# Altium project Mother Board.PrjPcb (part 2 of 2)

## Sheet Mother Board FPGA.SchDoc
size A2
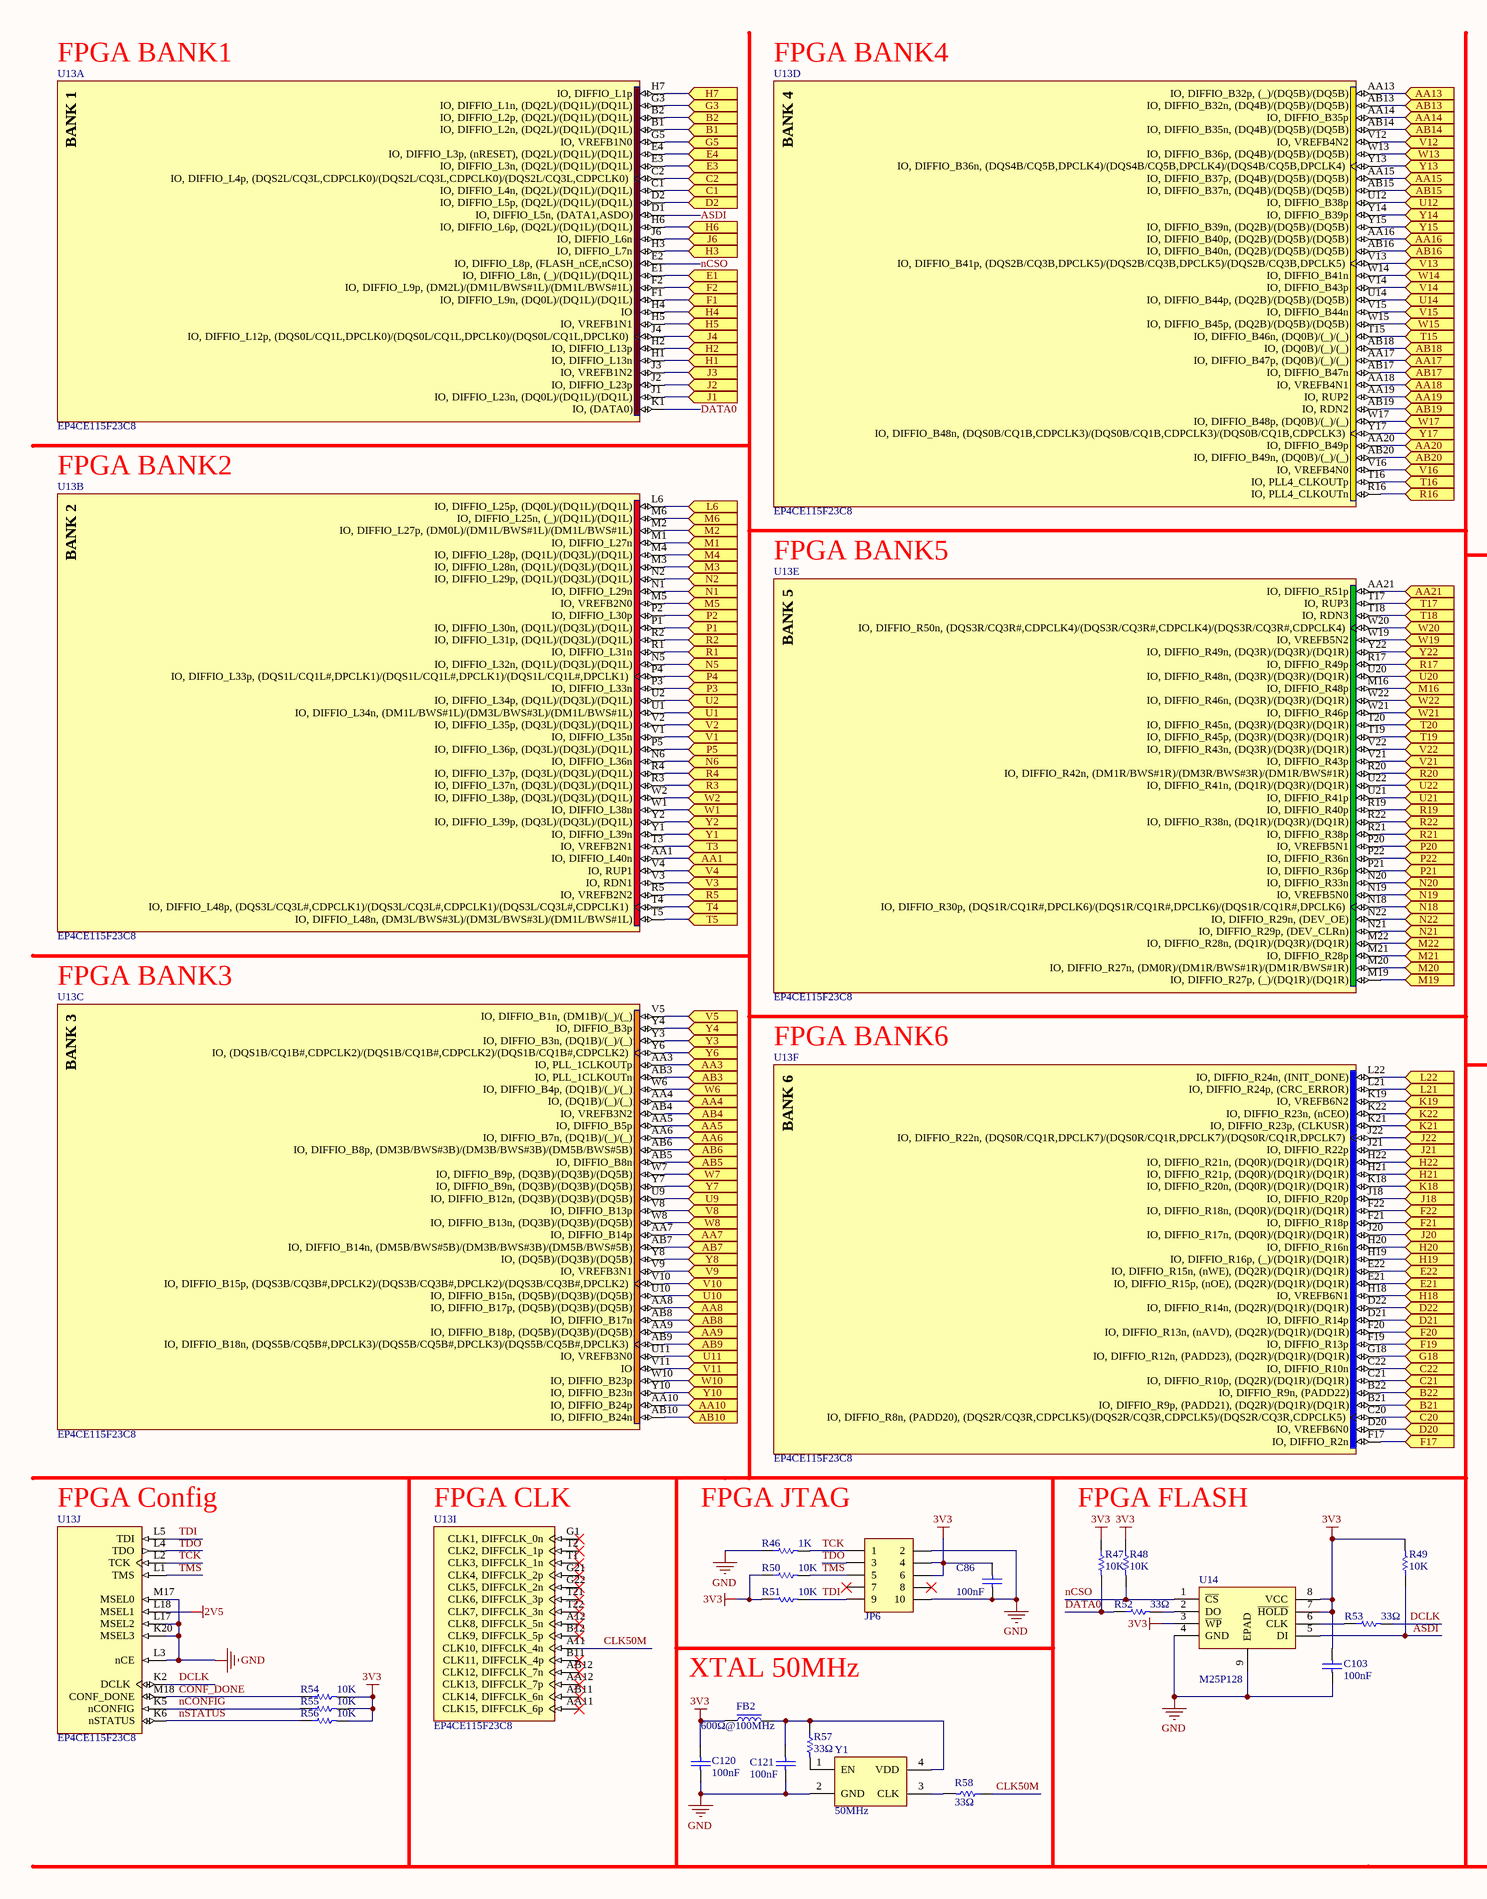
[diagram p8: Mother Board FPGA.SchDoc, left]
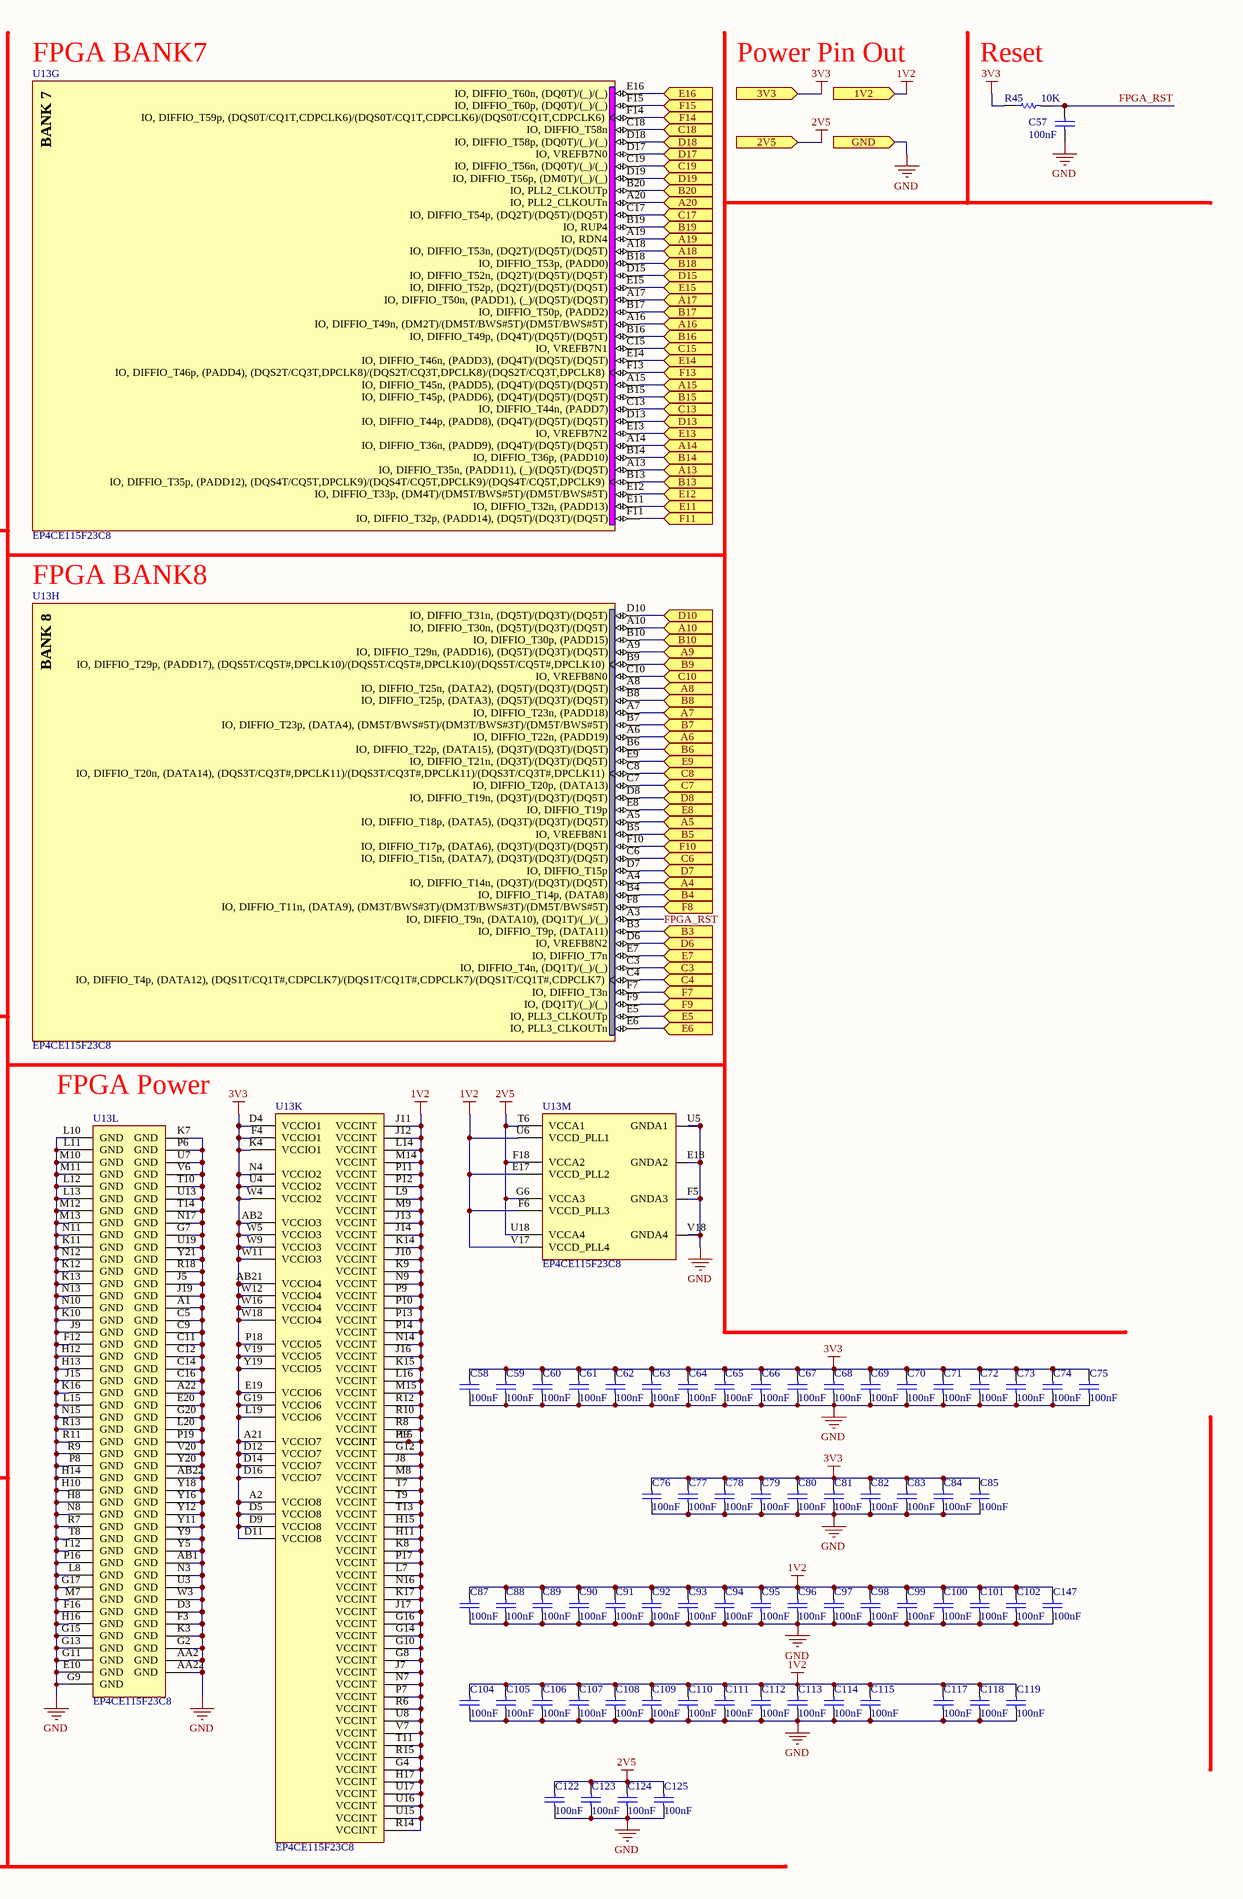
[diagram p9: Mother Board FPGA.SchDoc, right]

### Parts
C57  100nF  [C0402]
C58  100nF  [C0402]
C59  100nF  [C0402]
C60  100nF  [C0402]
C61  100nF  [C0402]
C62  100nF  [C0402]
C63  100nF  [C0402]
C64  100nF  [C0402]
C65  100nF  [C0402]
C66  100nF  [C0402]
C67  100nF  [C0402]
C68  100nF  [C0402]
C69  100nF  [C0402]
C70  100nF  [C0402]
C71  100nF  [C0402]
C72  100nF  [C0402]
C73  100nF  [C0402]
C74  100nF  [C0402]
C75  100nF  [C0402]
C76  100nF  [C0402]
C77  100nF  [C0402]
C78  100nF  [C0402]
C79  100nF  [C0402]
C80  100nF  [C0402]
C81  100nF  [C0402]
C82  100nF  [C0402]
C83  100nF  [C0402]
C84  100nF  [C0402]
C85  100nF  [C0402]
C86  100nF  [C0603]
C87  100nF  [C0402]
C88  100nF  [C0402]
C89  100nF  [C0402]
C90  100nF  [C0402]
C91  100nF  [C0402]
C92  100nF  [C0402]
C93  100nF  [C0402]
C94  100nF  [C0402]
C95  100nF  [C0402]
C96  100nF  [C0402]
C97  100nF  [C0402]
C98  100nF  [C0402]
C99  100nF  [C0402]
C100  100nF  [C0402]
C101  100nF  [C0402]
C102  100nF  [C0402]
C103  100nF  [C0603]
C104  100nF  [C0402]
C105  100nF  [C0402]
C106  100nF  [C0402]
C107  100nF  [C0402]
C108  100nF  [C0402]
C109  100nF  [C0402]
C110  100nF  [C0402]
C111  100nF  [C0402]
C112  100nF  [C0402]
C113  100nF  [C0402]
C114  100nF  [C0402]
C115  100nF  [C0402]
C117  100nF  [C0402]
C118  100nF  [C0402]
C119  100nF  [C0402]
C120  100nF  [C0603]
C121  100nF  [C0603]
C122  100nF  [C0402]
C123  100nF  [C0402]
C124  100nF  [C0402]
C125  100nF  [C0402]
C147  100nF  [C0402]
FB2  600Ω@100MHz  [FB 0603]
JP6  Header 5X2  [DC2.54-10P - L2]  (value not drawn)
R45  10K  [R0402]
R46  1K  [R0603]
R47  10K  [R0603]
R48  10K  [R0603]
R49  10K  [R0603]
R50  10K  [R0603]
R51  10K  [R0603]
R52  33Ω  [R0603]
R53  33Ω  [R0603]
R54  10K  [R0402]
R55  10K  [R0402]
R56  10K  [R0402]
R57  33Ω  [R0603]
R58  33Ω  [R0603]
U13  EP4CE115F23C8  [FBGA484]  (parts A,B,C,D,E,F,G,H,I,J,K,L,M of 13)
U14  M25P128  [WSON8_8X6_MRN]
Y1  50MHz  [XTAL-3225]

### Ports
1V2 (in), 2V5 (in), 3V3 (in), A4 (in), A5 (in), A6 (in), A7 (in), A8 (in), A9 (in), A10 (in), A13 (in), A14 (in), A15 (in), A16 (in), A17 (in), A18 (in), A19 (in), A20 (in), AA1 (in), AA3 (in), AA4 (in), AA5 (in), AA6 (in), AA7 (in), AA8 (in), AA9 (in), AA10 (in), AA13 (in), AA14 (in), AA15 (in), AA16 (in), AA17 (in), AA18 (in), AA19 (in), AA20 (in), AA21 (in), AB3 (in), AB4 (in), AB5 (in), AB6 (in), AB7 (in), AB8 (in), AB9 (in), AB10 (in), AB13 (in), AB14 (in), AB15 (in), AB16 (in), AB17 (in), AB18 (in), AB19 (in), AB20 (in), B1 (in), B2 (in), B3 (in), B4 (in), B5 (in), B6 (in), B7 (in), B8 (in), B9 (in), B10 (in), B13 (in), B14 (in), B15 (in), B16 (in), B17 (in), B18 (in), B19 (in), B20 (in), B21 (in), B22 (in), C1 (in), C2 (in), C3 (in), C4 (in), C6 (in), C7 (in), C8 (in), C10 (in), C13 (in), C15 (in), C17 (in), C18 (in), C19 (in), C20 (in), C21 (in), C22 (in), D2 (in), D6 (in), D7 (in), D8 (in), D10 (in), D13 (in), D15 (in), D17 (in), D18 (in), D19 (in), D20 (in), D21 (in), D22 (in), E1 (in), E3 (in), E4 (in), E5 (in), E6 (in), E7 (in), E8 (in), E9 (in), E11 (in), E12 (in), E13 (in), E14 (in), E15 (in), E16 (in), E21 (in), E22 (in), F1 (in), F2 (in), F7 (in), F8 (in), F9 (in), F10 (in), F11 (in), F13 (in), F14 (in), F15 (in), F17 (in), F19 (in), F20 (in), F21 (in), F22 (in), G3 (in), G5 (in), G18 (in), GND (in), H1 (in), H2 (in), H3 (in), H4 (in), H5 (in), H6 (in), H7 (in), H18 (in), H19 (in), H20 (in), H21 (in), H22 (in), J1 (in), J2 (in), J3 (in), J4 (in), J6 (in), J18 (in), J20 (in), J21 (in), J22 (in), K18 (in), K19 (in), K21 (in), K22 (in), L6 (in), L21 (in), L22 (in), M1 (in), M2 (in), M3 (in), M4 (in), M5 (in), M6 (in), M16 (in), M19 (in), M20 (in), M21 (in), M22 (in), N1 (in), N2 (in), N5 (in), N6 (in), N18 (in), N19 (in), N20 (in), N21 (in), N22 (in), P1 (in), P2 (in), P3 (in), P4 (in), P5 (in), P20 (in), P21 (in), P22 (in), R1 (in), R2 (in), R3 (in), R4 (in), R5 (in), R16 (in), R17 (in), R19 (in), R20 (in), R21 (in), R22 (in), T3 (in), T4 (in), T5 (in), T15 (in), T16 (in), T17 (in), T18 (in), T19 (in), T20 (in), U1 (in), U2 (in), U9 (in), U10 (in), U11 (in), U12 (in), U14 (in), U20 (in), U21 (in), U22 (in), V1 (in), V2 (in), V3 (in), V4 (in), V5 (in), V8 (in), V9 (in), V10 (in), V11 (in), V12 (in), V13 (in), V14 (in), V15 (in), V16 (in), V21 (in), V22 (in), W1 (in), W2 (in), W6 (in), W7 (in), W8 (in), W10 (in), W13 (in), W14 (in), W15 (in), W17 (in), W19 (in), W20 (in), W21 (in), W22 (in), Y1 (in), Y2 (in), Y3 (in), Y4 (in), Y6 (in), Y7 (in), Y8 (in), Y10 (in), Y13 (in), Y14 (in), Y15 (in), Y17 (in), Y22 (in)

### Nets
1V2: C87.2 C88.2 C89.2 C90.2 C91.2 C92.2 C93.2 C94.2 C95.2 C96.2 C97.2 C98.2 C99.2 C100.2 C101.2 C102.2 C104.2 C105.2 C106.2 C107.2 C108.2 C109.2 C110.2 C111.2 C112.2 C113.2 C114.2 C115.2 C117.2 C118.2 C119.2 C147.2 U13.E17(VCCD_PLL2) U13.F6(VCCD_PLL3) U13.G4(VCCINT) U13.G8(VCCINT) U13.G10(VCCINT) U13.G12(VCCINT) U13.G14(VCCINT) U13.G16(VCCINT) U13.H9(VCCINT) U13.H11(VCCINT) U13.H15(VCCINT) U13.H17(VCCINT) U13.J7(VCCINT) U13.J8(VCCINT) U13.J10(VCCINT) U13.J11(VCCINT) U13.J12(VCCINT) U13.J13(VCCINT) U13.J14(VCCINT) U13.J16(VCCINT) U13.J17(VCCINT) U13.K8(VCCINT) U13.K9(VCCINT) U13.K14(VCCINT) U13.K15(VCCINT) U13.K17(VCCINT) U13.L7(VCCINT) U13.L9(VCCINT) U13.L14(VCCINT) U13.L16(VCCINT) U13.M8(VCCINT) U13.M9(VCCINT) U13.M14(VCCINT) U13.M15(VCCINT) U13.N7(VCCINT) U13.N9(VCCINT) U13.N14(VCCINT) U13.N16(VCCINT) U13.P7(VCCINT) U13.P9(VCCINT) U13.P10(VCCINT) U13.P11(VCCINT) U13.P12(VCCINT) U13.P13(VCCINT) U13.P14(VCCINT) U13.P15(VCCINT) U13.P17(VCCINT) U13.R6(VCCINT) U13.R8(VCCINT) U13.R10(VCCINT) U13.R12(VCCINT) U13.R14(VCCINT) U13.R15(VCCINT) U13.T7(VCCINT) U13.T9(VCCINT) U13.T11(VCCINT) U13.T13(VCCINT) U13.U6(VCCD_PLL1) U13.U8(VCCINT) U13.U15(VCCINT) U13.U16(VCCINT) U13.U17(VCCINT) U13.V7(VCCINT) U13.V17(VCCD_PLL4) ; port 1V2
2V5: C122.2 C123.2 C124.2 C125.2 U13.F18(VCCA2) U13.G6(VCCA3) U13.L18(MSEL1) U13.T6(VCCA1) U13.U18(VCCA4) ; port 2V5
3V3: C58.2 C59.2 C60.2 C61.2 C62.2 C63.2 C64.2 C65.2 C66.2 C67.2 C68.2 C69.2 C70.2 C71.2 C72.2 C73.2 C74.2 C75.2 C76.2 C77.2 C78.2 C79.2 C80.2 C81.2 C82.2 C83.2 C84.2 C85.2 C86.2 C103.1 C120.1 FB2.1 JP6.4 JP6.6 R45.1 R47.1 R48.1 R49.2 R50.1 R51.1 R54.2 R55.2 R56.2 U13.A2(VCCIO8) U13.A21(VCCIO7) U13.AB2(VCCIO3) U13.AB21(VCCIO4) U13.D4(VCCIO1) U13.D5(VCCIO8) U13.D9(VCCIO8) U13.D11(VCCIO8) U13.D12(VCCIO7) U13.D14(VCCIO7) U13.D16(VCCIO7) U13.E19(VCCIO6) U13.F4(VCCIO1) U13.G19(VCCIO6) U13.K4(VCCIO1) U13.L19(VCCIO6) U13.N4(VCCIO2) U13.P18(VCCIO5) U13.U4(VCCIO2) U13.V19(VCCIO5) U13.W4(VCCIO2) U13.W5(VCCIO3) U13.W9(VCCIO3) U13.W11(VCCIO3) U13.W12(VCCIO4) U13.W16(VCCIO4) U13.W18(VCCIO4) U13.Y19(VCCIO5) U14.3(~{WP}) U14.7(~{HOLD}) U14.8(VCC) ; port 3V3
GND: C57.1 C58.1 C59.1 C60.1 C61.1 C62.1 C63.1 C64.1 C65.1 C66.1 C67.1 C68.1 C69.1 C70.1 C71.1 C72.1 C73.1 C74.1 C75.1 C76.1 C77.1 C78.1 C79.1 C80.1 C81.1 C82.1 C83.1 C84.1 C85.1 C86.1 C87.1 C88.1 C89.1 C90.1 C91.1 C92.1 C93.1 C94.1 C95.1 C96.1 C97.1 C98.1 C99.1 C100.1 C101.1 C102.1 C103.2 C104.1 C105.1 C106.1 C107.1 C108.1 C109.1 C110.1 C111.1 C112.1 C113.1 C114.1 C115.1 C117.1 C118.1 C119.1 C120.2 C121.1 C122.1 C123.1 C124.1 C125.1 C147.1 JP6.2 JP6.10 R46.1 U13.A1(GND) U13.A22(GND) U13.AA2(GND) U13.AA22(GND) U13.AB1(GND) U13.AB22(GND) U13.C5(GND) U13.C9(GND) U13.C11(GND) U13.C12(GND) U13.C14(GND) U13.C16(GND) U13.D3(GND) U13.E10(GND) U13.E18(GNDA2) U13.E20(GND) U13.F3(GND) U13.F5(GNDA3) U13.F12(GND) U13.F16(GND) U13.G2(GND) U13.G7(GND) U13.G9(GND) U13.G11(GND) U13.G13(GND) U13.G15(GND) U13.G17(GND) U13.G20(GND) U13.H8(GND) U13.H10(GND) U13.H12(GND) U13.H13(GND) U13.H14(GND) U13.H16(GND) U13.J5(GND) U13.J9(GND) U13.J15(GND) U13.J19(GND) U13.K3(GND) U13.K7(GND) U13.K10(GND) U13.K11(GND) U13.K12(GND) U13.K13(GND) U13.K16(GND) U13.K20(MSEL3) U13.L3(nCE) U13.L8(GND) U13.L10(GND) U13.L11(GND) U13.L12(GND) U13.L13(GND) U13.L15(GND) U13.L17(MSEL2) U13.L20(GND) U13.M7(GND) U13.M10(GND) U13.M11(GND) U13.M12(GND) U13.M13(GND) U13.M17(MSEL0) U13.N3(GND) U13.N8(GND) U13.N10(GND) U13.N11(GND) U13.N12(GND) U13.N13(GND) U13.N15(GND) U13.N17(GND) U13.P6(GND) U13.P8(GND) U13.P16(GND) U13.P19(GND) U13.R7(GND) U13.R9(GND) U13.R11(GND) U13.R13(GND) U13.R18(GND) U13.T8(GND) U13.T10(GND) U13.T12(GND) U13.T14(GND) U13.U3(GND) U13.U5(GNDA1) U13.U7(GND) U13.U13(GND) U13.U19(GND) U13.V6(GND) U13.V18(GNDA4) U13.V20(GND) U13.W3(GND) U13.Y5(GND) U13.Y9(GND) U13.Y11(GND) U13.Y12(GND) U13.Y16(GND) U13.Y18(GND) U13.Y20(GND) U13.Y21(GND) U14.4(GND) U14.9(EPAD) Y1.2(GND) ; port GND
ASDI: R49.1 U13.D1(IO,_DIFFIO_L5n,_(DATA1,ASDO)) U14.5(DI)
CLK50M: R58.1 U13.A11(CLK10,_DIFFCLK_4n)
ClkA: U13.M22(IO,_DIFFIO_R28n,_(DQ1R)/(DQ3R)/(DQ1R)) ; port M22
ClkA: U13.N1(IO,_DIFFIO_L29n) ; port N1  [a separate net that carries the same name]
ClkA: U13.W2(IO,_DIFFIO_L38p,_(DQ3L)/(DQ3L)/(DQ1L)) ; port W2  [a separate net that carries the same name]
ClkA: U13.V21(IO,_DIFFIO_R43p) ; port V21  [a separate net that carries the same name]
ClkC: U13.W22(IO,_DIFFIO_R46n,_(DQ3R)/(DQ3R)/(DQ1R)) ; port W22
ClkC: U13.M2(IO,_DIFFIO_L27p,_(DM0L)/(DM1L/BWS#1L)/(DM1L/BWS#1L)) ; port M2  [a separate net that carries the same name]
ClkC: U13.V1(IO,_DIFFIO_L35n) ; port V1  [a separate net that carries the same name]
ClkC: U13.N21(IO,_DIFFIO_R29p,_(DEV_CLRn)) ; port N21  [a separate net that carries the same name]
ClkVIN: U13.L21(IO,_DIFFIO_R24p,_(CRC_ERROR)) ; port L21
CONF_DONE: R54.1 U13.M18(CONF_DONE)
DATA0: R47.2 R52.1 U13.K1(IO,_(DATA0))
DataA: U13.M21(IO,_DIFFIO_R28p) ; port M21
DataA: U13.N2(IO,_DIFFIO_L29p,_(DQ1L)/(DQ3L)/(DQ1L)) ; port N2  [a separate net that carries the same name]
DataA: U13.W1(IO,_DIFFIO_L38n) ; port W1  [a separate net that carries the same name]
DataA: U13.V22(IO,_DIFFIO_R43n,_(DQ3R)/(DQ3R)/(DQ1R)) ; port V22  [a separate net that carries the same name]
DataC: U13.W21(IO,_DIFFIO_R46p) ; port W21
DataC: U13.M1(IO,_DIFFIO_L27n) ; port M1  [a separate net that carries the same name]
DataC: U13.V2(IO,_DIFFIO_L35p,_(DQ3L)/(DQ3L)/(DQ1L)) ; port V2  [a separate net that carries the same name]
DataC: U13.N22(IO,_DIFFIO_R29n,_(DEV_OE)) ; port N22  [a separate net that carries the same name]
DataVIN: U13.L22(IO,_DIFFIO_R24n,_(INIT_DONE)) ; port L22
DCLK: R53.2 U13.K2(DCLK)
FPGA_RST: C57.2 R45.2 U13.A3(IO,_DIFFIO_T9n,_(DATA10),_(DQ1T)/(_)/(_))
FSMC_A0: U13.AA7(IO,_DIFFIO_B14p) ; port AA7
FSMC_A1: U13.AB7(IO,_DIFFIO_B14n,_(DM5B/BWS#5B)/(DM3B/BWS#3B)/(DM5B/BWS#5B)) ; port AB7
FSMC_A2: U13.AA8(IO,_DIFFIO_B17p,_(DQ5B)/(DQ3B)/(DQ5B)) ; port AA8
FSMC_A3: U13.AB8(IO,_DIFFIO_B17n) ; port AB8
FSMC_A4: U13.AA9(IO,_DIFFIO_B18p,_(DQ5B)/(DQ3B)/(DQ5B)) ; port AA9
FSMC_A5: U13.AB9(IO,_DIFFIO_B18n,_(DQS5B/CQ5B#,DPCLK3)/(DQS5B/CQ5B#,DPCLK3)/(DQS5B/CQ5B#,DPCLK3)) ; port AB9
FSMC_A6: U13.Y13(IO,_DIFFIO_B36n,_(DQS4B/CQ5B,DPCLK4)/(DQS4B/CQ5B,DPCLK4)/(DQS4B/CQ5B,DPCLK4)) ; port Y13
FSMC_A7: U13.Y14(IO,_DIFFIO_B39p) ; port Y14
FSMC_A8: U13.Y15(IO,_DIFFIO_B39n,_(DQ2B)/(DQ5B)/(DQ5B)) ; port Y15
FSMC_A9: U13.AA15(IO,_DIFFIO_B37p,_(DQ4B)/(DQ5B)/(DQ5B)) ; port AA15
FSMC_A10: U13.AA16(IO,_DIFFIO_B40p,_(DQ2B)/(DQ5B)/(DQ5B)) ; port AA16
FSMC_A11: U13.AB16(IO,_DIFFIO_B40n,_(DQ2B)/(DQ5B)/(DQ5B)) ; port AB16
FSMC_D0: U13.AB13(IO,_DIFFIO_B32n,_(DQ4B)/(DQ5B)/(DQ5B)) ; port AB13
FSMC_D1: U13.AA13(IO,_DIFFIO_B32p,_(_)/(DQ5B)/(DQ5B)) ; port AA13
FSMC_D2: U13.AA5(IO,_DIFFIO_B5p) ; port AA5
FSMC_D3: U13.AB5(IO,_DIFFIO_B8n) ; port AB5
FSMC_D4: U13.AA17(IO,_DIFFIO_B47p,_(DQ0B)/(_)/(_)) ; port AA17
FSMC_D5: U13.AB17(IO,_DIFFIO_B47n) ; port AB17
FSMC_D6: U13.AA18(IO,_VREFB4N1) ; port AA18
FSMC_D7: U13.AB18(IO,_(DQ0B)/(_)/(_)) ; port AB18
FSMC_D8: U13.AA19(IO,_RUP2) ; port AA19
FSMC_D9: U13.AB19(IO,_RDN2) ; port AB19
FSMC_D10: U13.AA20(IO,_DIFFIO_B49p) ; port AA20
FSMC_D11: U13.AB20(IO,_DIFFIO_B49n,_(DQ0B)/(_)/(_)) ; port AB20
FSMC_D12: U13.AA21(IO,_DIFFIO_R51p) ; port AA21
FSMC_D13: U13.AB15(IO,_DIFFIO_B37n,_(DQ4B)/(DQ5B)/(DQ5B)) ; port AB15
FSMC_D14: U13.AB14(IO,_DIFFIO_B35n,_(DQ4B)/(DQ5B)/(DQ5B)) ; port AB14
FSMC_D15: U13.AA14(IO,_DIFFIO_B35p) ; port AA14
FSMC_NE2: U13.AB4(IO,_VREFB3N2) ; port AB4
FSMC_NOE: U13.AA6(IO,_DIFFIO_B7n,_(DQ1B)/(_)/(_)) ; port AA6
FSMC_NWE: U13.AB6(IO,_DIFFIO_B8p,_(DM3B/BWS#3B)/(DM3B/BWS#3B)/(DM5B/BWS#5B)) ; port AB6
IMU nCS BMP280: U13.H1(IO,_DIFFIO_L13n) ; port H1
IMU nCS MPU9250: U13.F2(IO,_DIFFIO_L9p,_(DM2L)/(DM1L/BWS#1L)/(DM1L/BWS#1L)) ; port F2
IMU SCLK: U13.F1(IO,_DIFFIO_L9n,_(DQ0L)/(DQ1L)/(DQ1L)) ; port F1
IMU SDI: U13.H2(IO,_DIFFIO_L13p) ; port H2
IMU SDO: U13.J2(IO,_DIFFIO_L23p) ; port J2
INa: U13.R20(IO,_DIFFIO_R42n,_(DM1R/BWS#1R)/(DM3R/BWS#3R)/(DM1R/BWS#1R)) ; port R20
INa: U13.P2(IO,_DIFFIO_L30p) ; port P2  [a separate net that carries the same name]
INa: U13.T4(IO,_DIFFIO_L48p,_(DQS3L/CQ3L#,CDPCLK1)/(DQS3L/CQ3L#,CDPCLK1)/(DQS3L/CQ3L#,CDPCLK1)) ; port T4  [a separate net that carries the same name]
INa: U13.U22(IO,_DIFFIO_R41n,_(DQ1R)/(DQ3R)/(DQ1R)) ; port U22  [a separate net that carries the same name]
INb: U13.T20(IO,_DIFFIO_R45n,_(DQ3R)/(DQ3R)/(DQ1R)) ; port T20
INb: U13.R2(IO,_DIFFIO_L31p,_(DQ1L)/(DQ3L)/(DQ1L)) ; port R2  [a separate net that carries the same name]
INb: U13.R4(IO,_DIFFIO_L37p,_(DQ3L)/(DQ3L)/(DQ1L)) ; port R4  [a separate net that carries the same name]
INb: U13.R22(IO,_DIFFIO_R38n,_(DQ1R)/(DQ3R)/(DQ1R)) ; port R22  [a separate net that carries the same name]
INc: U13.U20(IO,_DIFFIO_R48n,_(DQ3R)/(DQ3R)/(DQ1R)) ; port U20
INc: U13.P4(IO,_DIFFIO_L33p,_(DQS1L/CQ1L#,DPCLK1)/(DQS1L/CQ1L#,DPCLK1)/(DQS1L/CQ1L#,DPCLK1)) ; port P4  [a separate net that carries the same name]
INc: U13.U2(IO,_DIFFIO_L34p,_(DQ1L)/(DQ3L)/(DQ1L)) ; port U2  [a separate net that carries the same name]
INc: U13.P22(IO,_DIFFIO_R36n) ; port P22  [a separate net that carries the same name]
nCONFIG: R55.1 U13.K5(nCONFIG)
nCSO: R48.2 U13.E2(IO,_DIFFIO_L8p,_(FLASH_nCE,nCSO)) U14.1(~{CS})
nSTATUS: R56.1 U13.K6(nSTATUS)
Pos DIR: U13.B22(IO,_DIFFIO_R9n,_(PADD22)) ; port B22
Pos DIR: U13.B1(IO,_DIFFIO_L2n,_(DQ2L)/(DQ1L)/(DQ1L)) ; port B1  [a separate net that carries the same name]
Pos DIR: U13.AB3(IO,_PLL_1CLKOUTn) ; port AB3  [a separate net that carries the same name]
Pos DIR: U13.AA10(IO,_DIFFIO_B24p) ; port AA10  [a separate net that carries the same name]
Pos RXD: U13.B21(IO,_DIFFIO_R9p,_(PADD21),_(DQ2R)/(DQ1R)/(DQ1R)) ; port B21
Pos RXD: U13.C2(IO,_DIFFIO_L4p,_(DQS2L/CQ3L,CDPCLK0)/(DQS2L/CQ3L,CDPCLK0)/(DQS2L/CQ3L,CDPCLK0)) ; port C2  [a separate net that carries the same name]
Pos RXD: U13.AA4(IO,_(DQ1B)/(_)/(_)) ; port AA4  [a separate net that carries the same name]
Pos RXD: U13.AB10(IO,_DIFFIO_B24n) ; port AB10  [a separate net that carries the same name]
Pos TXD: U13.C21(IO,_DIFFIO_R10p,_(DQ2R)/(DQ1R)/(DQ1R)) ; port C21
Pos TXD: U13.B2(IO,_DIFFIO_L2p,_(DQ2L)/(DQ1L)/(DQ1L)) ; port B2  [a separate net that carries the same name]
Pos TXD: U13.AA3(IO,_PLL_1CLKOUTp) ; port AA3  [a separate net that carries the same name]
Pos TXD: U13.Y10(IO,_DIFFIO_B23n) ; port Y10  [a separate net that carries the same name]
SDa: U13.P20(IO,_VREFB5N1) ; port P20
SDa: U13.P1(IO,_DIFFIO_L30n,_(DQ1L)/(DQ3L)/(DQ1L)) ; port P1  [a separate net that carries the same name]
SDa: U13.T3(IO,_VREFB2N1) ; port T3  [a separate net that carries the same name]
SDa: U13.U21(IO,_DIFFIO_R41p) ; port U21  [a separate net that carries the same name]
SDb: U13.R19(IO,_DIFFIO_R40p) ; port R19
SDb: U13.R1(IO,_DIFFIO_L31n) ; port R1  [a separate net that carries the same name]
SDb: U13.R3(IO,_DIFFIO_L37n,_(DQ3L)/(DQ3L)/(DQ1L)) ; port R3  [a separate net that carries the same name]
SDb: U13.R21(IO,_DIFFIO_R38p) ; port R21  [a separate net that carries the same name]
SDc: U13.T19(IO,_DIFFIO_R45p,_(DQ3R)/(DQ3R)/(DQ1R)) ; port T19
SDc: U13.P3(IO,_DIFFIO_L33n) ; port P3  [a separate net that carries the same name]
SDc: U13.U1(IO,_DIFFIO_L34n,_(DM1L/BWS#1L)/(DM3L/BWS#3L)/(DM1L/BWS#1L)) ; port U1  [a separate net that carries the same name]
SDc: U13.P21(IO,_DIFFIO_R36p) ; port P21  [a separate net that carries the same name]
TCK: JP6.1 R46.2 U13.L2(TCK)
TDI: JP6.9 R51.2 U13.L5(TDI)
TDO: JP6.3 U13.L4(TDO)
TMS: JP6.5 R50.2 U13.L1(TMS)
NetC121_2: C121.2 FB2.2 R57.1 Y1.4(VDD)
NetR52_2: R52.2 U14.2(DO)
NetR53_1: R53.1 U14.6(CLK)
NetR57_2: R57.2 Y1.1(EN)
NetR58_2: R58.2 Y1.3(CLK)
NetU13_A4: U13.A4(IO,_DIFFIO_T14n,_(DQ3T)/(DQ3T)/(DQ5T)) ; port A4
NetU13_A5: U13.A5(IO,_DIFFIO_T18p,_(DATA5),_(DQ3T)/(DQ3T)/(DQ5T)) ; port A5
NetU13_A6: U13.A6(IO,_DIFFIO_T22n,_(PADD19)) ; port A6
NetU13_A7: U13.A7(IO,_DIFFIO_T23n,_(PADD18)) ; port A7
NetU13_A8: U13.A8(IO,_DIFFIO_T25n,_(DATA2),_(DQ5T)/(DQ3T)/(DQ5T)) ; port A8
NetU13_A9: U13.A9(IO,_DIFFIO_T29n,_(PADD16),_(DQ5T)/(DQ3T)/(DQ5T)) ; port A9
NetU13_A10: U13.A10(IO,_DIFFIO_T30n,_(DQ5T)/(DQ3T)/(DQ5T)) ; port A10
NetU13_A13: U13.A13(IO,_DIFFIO_T35n,_(PADD11),_(_)/(DQ5T)/(DQ5T)) ; port A13
NetU13_A14: U13.A14(IO,_DIFFIO_T36n,_(PADD9),_(DQ4T)/(DQ5T)/(DQ5T)) ; port A14
NetU13_A15: U13.A15(IO,_DIFFIO_T45n,_(PADD5),_(DQ4T)/(DQ5T)/(DQ5T)) ; port A15
NetU13_A16: U13.A16(IO,_DIFFIO_T49n,_(DM2T)/(DM5T/BWS#5T)/(DM5T/BWS#5T)) ; port A16
NetU13_A17: U13.A17(IO,_DIFFIO_T50n,_(PADD1),_(_)/(DQ5T)/(DQ5T)) ; port A17
NetU13_A18: U13.A18(IO,_DIFFIO_T53n,_(DQ2T)/(DQ5T)/(DQ5T)) ; port A18
NetU13_A19: U13.A19(IO,_RDN4) ; port A19
NetU13_A20: U13.A20(IO,_PLL2_CLKOUTn) ; port A20
NetU13_AA1: U13.AA1(IO,_DIFFIO_L40n) ; port AA1
NetU13_B3: U13.B3(IO,_DIFFIO_T9p,_(DATA11)) ; port B3
NetU13_B4: U13.B4(IO,_DIFFIO_T14p,_(DATA8)) ; port B4
NetU13_B5: U13.B5(IO,_VREFB8N1) ; port B5
NetU13_B6: U13.B6(IO,_DIFFIO_T22p,_(DATA15),_(DQ3T)/(DQ3T)/(DQ5T)) ; port B6
NetU13_B7: U13.B7(IO,_DIFFIO_T23p,_(DATA4),_(DM5T/BWS#5T)/(DM3T/BWS#3T)/(DM5T/BWS#5T)) ; port B7
NetU13_B8: U13.B8(IO,_DIFFIO_T25p,_(DATA3),_(DQ5T)/(DQ3T)/(DQ5T)) ; port B8
NetU13_B9: U13.B9(IO,_DIFFIO_T29p,_(PADD17),_(DQS5T/CQ5T#,DPCLK10)/(DQS5T/CQ5T#,DPCLK10)/(DQS5T/CQ5T#,DPCLK10)) ; port B9
NetU13_B10: U13.B10(IO,_DIFFIO_T30p,_(PADD15)) ; port B10
NetU13_B13: U13.B13(IO,_DIFFIO_T35p,_(PADD12),_(DQS4T/CQ5T,DPCLK9)/(DQS4T/CQ5T,DPCLK9)/(DQS4T/CQ5T,DPCLK9)) ; port B13
NetU13_B14: U13.B14(IO,_DIFFIO_T36p,_(PADD10)) ; port B14
NetU13_B15: U13.B15(IO,_DIFFIO_T45p,_(PADD6),_(DQ4T)/(DQ5T)/(DQ5T)) ; port B15
NetU13_B16: U13.B16(IO,_DIFFIO_T49p,_(DQ4T)/(DQ5T)/(DQ5T)) ; port B16
NetU13_B17: U13.B17(IO,_DIFFIO_T50p,_(PADD2)) ; port B17
NetU13_B18: U13.B18(IO,_DIFFIO_T53p,_(PADD0)) ; port B18
NetU13_B19: U13.B19(IO,_RUP4) ; port B19
NetU13_B20: U13.B20(IO,_PLL2_CLKOUTp) ; port B20
NetU13_C1: U13.C1(IO,_DIFFIO_L4n,_(DQ2L)/(DQ1L)/(DQ1L)) ; port C1
NetU13_C3: U13.C3(IO,_DIFFIO_T4n,_(DQ1T)/(_)/(_)) ; port C3
NetU13_C4: U13.C4(IO,_DIFFIO_T4p,_(DATA12),_(DQS1T/CQ1T#,CDPCLK7)/(DQS1T/CQ1T#,CDPCLK7)/(DQS1T/CQ1T#,CDPCLK7)) ; port C4
NetU13_C6: U13.C6(IO,_DIFFIO_T15n,_(DATA7),_(DQ3T)/(DQ3T)/(DQ5T)) ; port C6
NetU13_C7: U13.C7(IO,_DIFFIO_T20p,_(DATA13)) ; port C7
NetU13_C8: U13.C8(IO,_DIFFIO_T20n,_(DATA14),_(DQS3T/CQ3T#,DPCLK11)/(DQS3T/CQ3T#,DPCLK11)/(DQS3T/CQ3T#,DPCLK11)) ; port C8
NetU13_C10: U13.C10(IO,_VREFB8N0) ; port C10
NetU13_C13: U13.C13(IO,_DIFFIO_T44n,_(PADD7)) ; port C13
NetU13_C15: U13.C15(IO,_VREFB7N1) ; port C15
NetU13_C17: U13.C17(IO,_DIFFIO_T54p,_(DQ2T)/(DQ5T)/(DQ5T)) ; port C17
NetU13_C18: U13.C18(IO,_DIFFIO_T58n) ; port C18
NetU13_C19: U13.C19(IO,_DIFFIO_T56n,_(DQ0T)/(_)/(_)) ; port C19
NetU13_C20: U13.C20(IO,_DIFFIO_R8n,_(PADD20),_(DQS2R/CQ3R,CDPCLK5)/(DQS2R/CQ3R,CDPCLK5)/(DQS2R/CQ3R,CDPCLK5)) ; port C20
NetU13_C22: U13.C22(IO,_DIFFIO_R10n) ; port C22
NetU13_D2: U13.D2(IO,_DIFFIO_L5p,_(DQ2L)/(DQ1L)/(DQ1L)) ; port D2
NetU13_D6: U13.D6(IO,_VREFB8N2) ; port D6
NetU13_D7: U13.D7(IO,_DIFFIO_T15p) ; port D7
NetU13_D8: U13.D8(IO,_DIFFIO_T19n,_(DQ3T)/(DQ3T)/(DQ5T)) ; port D8
NetU13_D10: U13.D10(IO,_DIFFIO_T31n,_(DQ5T)/(DQ3T)/(DQ5T)) ; port D10
NetU13_D13: U13.D13(IO,_DIFFIO_T44p,_(PADD8),_(DQ4T)/(DQ5T)/(DQ5T)) ; port D13
NetU13_D15: U13.D15(IO,_DIFFIO_T52n,_(DQ2T)/(DQ5T)/(DQ5T)) ; port D15
NetU13_D17: U13.D17(IO,_VREFB7N0) ; port D17
NetU13_D18: U13.D18(IO,_DIFFIO_T58p,_(DQ0T)/(_)/(_)) ; port D18
NetU13_D19: U13.D19(IO,_DIFFIO_T56p,_(DM0T)/(_)/(_)) ; port D19
NetU13_D20: U13.D20(IO,_VREFB6N0) ; port D20
NetU13_D21: U13.D21(IO,_DIFFIO_R14p) ; port D21
NetU13_D22: U13.D22(IO,_DIFFIO_R14n,_(DQ2R)/(DQ1R)/(DQ1R)) ; port D22
NetU13_E1: U13.E1(IO,_DIFFIO_L8n,_(_)/(DQ1L)/(DQ1L)) ; port E1
NetU13_E3: U13.E3(IO,_DIFFIO_L3n,_(DQ2L)/(DQ1L)/(DQ1L)) ; port E3
NetU13_E4: U13.E4(IO,_DIFFIO_L3p,_(nRESET),_(DQ2L)/(DQ1L)/(DQ1L)) ; port E4
NetU13_E5: U13.E5(IO,_PLL3_CLKOUTp) ; port E5
NetU13_E6: U13.E6(IO,_PLL3_CLKOUTn) ; port E6
NetU13_E7: U13.E7(IO,_DIFFIO_T7n) ; port E7
NetU13_E8: U13.E8(IO,_DIFFIO_T19p) ; port E8
NetU13_E9: U13.E9(IO,_DIFFIO_T21n,_(DQ3T)/(DQ3T)/(DQ5T)) ; port E9
NetU13_E11: U13.E11(IO,_DIFFIO_T32n,_(PADD13)) ; port E11
NetU13_E12: U13.E12(IO,_DIFFIO_T33p,_(DM4T)/(DM5T/BWS#5T)/(DM5T/BWS#5T)) ; port E12
NetU13_E13: U13.E13(IO,_VREFB7N2) ; port E13
NetU13_E14: U13.E14(IO,_DIFFIO_T46n,_(PADD3),_(DQ4T)/(DQ5T)/(DQ5T)) ; port E14
NetU13_E15: U13.E15(IO,_DIFFIO_T52p,_(DQ2T)/(DQ5T)/(DQ5T)) ; port E15
NetU13_E16: U13.E16(IO,_DIFFIO_T60n,_(DQ0T)/(_)/(_)) ; port E16
NetU13_E21: U13.E21(IO,_DIFFIO_R15p,_(nOE),_(DQ2R)/(DQ1R)/(DQ1R)) ; port E21
NetU13_E22: U13.E22(IO,_DIFFIO_R15n,_(nWE),_(DQ2R)/(DQ1R)/(DQ1R)) ; port E22
NetU13_F7: U13.F7(IO,_DIFFIO_T3n) ; port F7
NetU13_F8: U13.F8(IO,_DIFFIO_T11n,_(DATA9),_(DM3T/BWS#3T)/(DM3T/BWS#3T)/(DM5T/BWS#5T)) ; port F8
NetU13_F9: U13.F9(IO,_(DQ1T)/(_)/(_)) ; port F9
NetU13_F10: U13.F10(IO,_DIFFIO_T17p,_(DATA6),_(DQ3T)/(DQ3T)/(DQ5T)) ; port F10
NetU13_F11: U13.F11(IO,_DIFFIO_T32p,_(PADD14),_(DQ5T)/(DQ3T)/(DQ5T)) ; port F11
NetU13_F13: U13.F13(IO,_DIFFIO_T46p,_(PADD4),_(DQS2T/CQ3T,DPCLK8)/(DQS2T/CQ3T,DPCLK8)/(DQS2T/CQ3T,DPCLK8)) ; port F13
NetU13_F14: U13.F14(IO,_DIFFIO_T59p,_(DQS0T/CQ1T,CDPCLK6)/(DQS0T/CQ1T,CDPCLK6)/(DQS0T/CQ1T,CDPCLK6)) ; port F14
NetU13_F15: U13.F15(IO,_DIFFIO_T60p,_(DQ0T)/(_)/(_)) ; port F15
NetU13_F17: U13.F17(IO,_DIFFIO_R2n) ; port F17
NetU13_F19: U13.F19(IO,_DIFFIO_R13p) ; port F19
NetU13_F20: U13.F20(IO,_DIFFIO_R13n,_(nAVD),_(DQ2R)/(DQ1R)/(DQ1R)) ; port F20
NetU13_F21: U13.F21(IO,_DIFFIO_R18p) ; port F21
NetU13_F22: U13.F22(IO,_DIFFIO_R18n,_(DQ0R)/(DQ1R)/(DQ1R)) ; port F22
NetU13_G3: U13.G3(IO,_DIFFIO_L1n,_(DQ2L)/(DQ1L)/(DQ1L)) ; port G3
NetU13_G5: U13.G5(IO,_VREFB1N0) ; port G5
NetU13_G18: U13.G18(IO,_DIFFIO_R12n,_(PADD23),_(DQ2R)/(DQ1R)/(DQ1R)) ; port G18
NetU13_H3: U13.H3(IO,_DIFFIO_L7n) ; port H3
NetU13_H4: U13.H4(IO) ; port H4
NetU13_H5: U13.H5(IO,_VREFB1N1) ; port H5
NetU13_H6: U13.H6(IO,_DIFFIO_L6p,_(DQ2L)/(DQ1L)/(DQ1L)) ; port H6
NetU13_H7: U13.H7(IO,_DIFFIO_L1p) ; port H7
NetU13_H18: U13.H18(IO,_VREFB6N1) ; port H18
NetU13_H19: U13.H19(IO,_DIFFIO_R16p,_(_)/(DQ1R)/(DQ1R)) ; port H19
NetU13_H20: U13.H20(IO,_DIFFIO_R16n) ; port H20
NetU13_H21: U13.H21(IO,_DIFFIO_R21p,_(DQ0R)/(DQ1R)/(DQ1R)) ; port H21
NetU13_H22: U13.H22(IO,_DIFFIO_R21n,_(DQ0R)/(DQ1R)/(DQ1R)) ; port H22
NetU13_J1: U13.J1(IO,_DIFFIO_L23n,_(DQ0L)/(DQ1L)/(DQ1L)) ; port J1
NetU13_J3: U13.J3(IO,_VREFB1N2) ; port J3
NetU13_J4: U13.J4(IO,_DIFFIO_L12p,_(DQS0L/CQ1L,DPCLK0)/(DQS0L/CQ1L,DPCLK0)/(DQS0L/CQ1L,DPCLK0)) ; port J4
NetU13_J6: U13.J6(IO,_DIFFIO_L6n) ; port J6
NetU13_J18: U13.J18(IO,_DIFFIO_R20p) ; port J18
NetU13_J20: U13.J20(IO,_DIFFIO_R17n,_(DQ0R)/(DQ1R)/(DQ1R)) ; port J20
NetU13_J21: U13.J21(IO,_DIFFIO_R22p) ; port J21
NetU13_J22: U13.J22(IO,_DIFFIO_R22n,_(DQS0R/CQ1R,DPCLK7)/(DQS0R/CQ1R,DPCLK7)/(DQS0R/CQ1R,DPCLK7)) ; port J22
NetU13_K18: U13.K18(IO,_DIFFIO_R20n,_(DQ0R)/(DQ1R)/(DQ1R)) ; port K18
NetU13_K19: U13.K19(IO,_VREFB6N2) ; port K19
NetU13_K21: U13.K21(IO,_DIFFIO_R23p,_(CLKUSR)) ; port K21
NetU13_K22: U13.K22(IO,_DIFFIO_R23n,_(nCEO)) ; port K22
NetU13_L6: U13.L6(IO,_DIFFIO_L25p,_(DQ0L)/(DQ1L)/(DQ1L)) ; port L6
NetU13_M3: U13.M3(IO,_DIFFIO_L28n,_(DQ1L)/(DQ3L)/(DQ1L)) ; port M3
NetU13_M4: U13.M4(IO,_DIFFIO_L28p,_(DQ1L)/(DQ3L)/(DQ1L)) ; port M4
NetU13_M5: U13.M5(IO,_VREFB2N0) ; port M5
NetU13_M6: U13.M6(IO,_DIFFIO_L25n,_(_)/(DQ1L)/(DQ1L)) ; port M6
NetU13_M16: U13.M16(IO,_DIFFIO_R48p) ; port M16
NetU13_M19: U13.M19(IO,_DIFFIO_R27p,_(_)/(DQ1R)/(DQ1R)) ; port M19
NetU13_M20: U13.M20(IO,_DIFFIO_R27n,_(DM0R)/(DM1R/BWS#1R)/(DM1R/BWS#1R)) ; port M20
NetU13_N5: U13.N5(IO,_DIFFIO_L32n,_(DQ1L)/(DQ3L)/(DQ1L)) ; port N5
NetU13_N6: U13.N6(IO,_DIFFIO_L36n) ; port N6
NetU13_N18: U13.N18(IO,_DIFFIO_R30p,_(DQS1R/CQ1R#,DPCLK6)/(DQS1R/CQ1R#,DPCLK6)/(DQS1R/CQ1R#,DPCLK6)) ; port N18
NetU13_N19: U13.N19(IO,_VREFB5N0) ; port N19
NetU13_N20: U13.N20(IO,_DIFFIO_R33n) ; port N20
NetU13_P5: U13.P5(IO,_DIFFIO_L36p,_(DQ3L)/(DQ3L)/(DQ1L)) ; port P5
NetU13_R5: U13.R5(IO,_VREFB2N2) ; port R5
NetU13_R16: U13.R16(IO,_PLL4_CLKOUTn) ; port R16
NetU13_R17: U13.R17(IO,_DIFFIO_R49p) ; port R17
NetU13_T5: U13.T5(IO,_DIFFIO_L48n,_(DM3L/BWS#3L)/(DM3L/BWS#3L)/(DM1L/BWS#1L)) ; port T5
NetU13_T15: U13.T15(IO,_DIFFIO_B46n,_(DQ0B)/(_)/(_)) ; port T15
NetU13_T16: U13.T16(IO,_PLL4_CLKOUTp) ; port T16
NetU13_T17: U13.T17(IO,_RUP3) ; port T17
NetU13_T18: U13.T18(IO,_RDN3) ; port T18
NetU13_U9: U13.U9(IO,_DIFFIO_B12n,_(DQ3B)/(DQ3B)/(DQ5B)) ; port U9
NetU13_U10: U13.U10(IO,_DIFFIO_B15n,_(DQ5B)/(DQ3B)/(DQ5B)) ; port U10
NetU13_U11: U13.U11(IO,_VREFB3N0) ; port U11
NetU13_U12: U13.U12(IO,_DIFFIO_B38p) ; port U12
NetU13_U14: U13.U14(IO,_DIFFIO_B44p,_(DQ2B)/(DQ5B)/(DQ5B)) ; port U14
NetU13_V3: U13.V3(IO,_RDN1) ; port V3
NetU13_V4: U13.V4(IO,_RUP1) ; port V4
NetU13_V5: U13.V5(IO,_DIFFIO_B1n,_(DM1B)/(_)/(_)) ; port V5
NetU13_V8: U13.V8(IO,_DIFFIO_B13p) ; port V8
NetU13_V9: U13.V9(IO,_VREFB3N1) ; port V9
NetU13_V10: U13.V10(IO,_DIFFIO_B15p,_(DQS3B/CQ3B#,DPCLK2)/(DQS3B/CQ3B#,DPCLK2)/(DQS3B/CQ3B#,DPCLK2)) ; port V10
NetU13_V11: U13.V11(IO) ; port V11
NetU13_V12: U13.V12(IO,_VREFB4N2) ; port V12
NetU13_V13: U13.V13(IO,_DIFFIO_B41p,_(DQS2B/CQ3B,DPCLK5)/(DQS2B/CQ3B,DPCLK5)/(DQS2B/CQ3B,DPCLK5)) ; port V13
NetU13_V14: U13.V14(IO,_DIFFIO_B43p) ; port V14
NetU13_V15: U13.V15(IO,_DIFFIO_B44n) ; port V15
NetU13_V16: U13.V16(IO,_VREFB4N0) ; port V16
NetU13_W6: U13.W6(IO,_DIFFIO_B4p,_(DQ1B)/(_)/(_)) ; port W6
NetU13_W7: U13.W7(IO,_DIFFIO_B9p,_(DQ3B)/(DQ3B)/(DQ5B)) ; port W7
NetU13_W8: U13.W8(IO,_DIFFIO_B13n,_(DQ3B)/(DQ3B)/(DQ5B)) ; port W8
NetU13_W10: U13.W10(IO,_DIFFIO_B23p) ; port W10
NetU13_W13: U13.W13(IO,_DIFFIO_B36p,_(DQ4B)/(DQ5B)/(DQ5B)) ; port W13
NetU13_W14: U13.W14(IO,_DIFFIO_B41n) ; port W14
NetU13_W15: U13.W15(IO,_DIFFIO_B45p,_(DQ2B)/(DQ5B)/(DQ5B)) ; port W15
NetU13_W17: U13.W17(IO,_DIFFIO_B48p,_(DQ0B)/(_)/(_)) ; port W17
NetU13_W19: U13.W19(IO,_VREFB5N2) ; port W19
NetU13_W20: U13.W20(IO,_DIFFIO_R50n,_(DQS3R/CQ3R#,CDPCLK4)/(DQS3R/CQ3R#,CDPCLK4)/(DQS3R/CQ3R#,CDPCLK4)) ; port W20
NetU13_Y1: U13.Y1(IO,_DIFFIO_L39n) ; port Y1
NetU13_Y2: U13.Y2(IO,_DIFFIO_L39p,_(DQ3L)/(DQ3L)/(DQ1L)) ; port Y2
NetU13_Y3: U13.Y3(IO,_DIFFIO_B3n,_(DQ1B)/(_)/(_)) ; port Y3
NetU13_Y4: U13.Y4(IO,_DIFFIO_B3p) ; port Y4
NetU13_Y6: U13.Y6(IO,_(DQS1B/CQ1B#,CDPCLK2)/(DQS1B/CQ1B#,CDPCLK2)/(DQS1B/CQ1B#,CDPCLK2)) ; port Y6
NetU13_Y7: U13.Y7(IO,_DIFFIO_B9n,_(DQ3B)/(DQ3B)/(DQ5B)) ; port Y7
NetU13_Y8: U13.Y8(IO,_(DQ5B)/(DQ3B)/(DQ5B)) ; port Y8
NetU13_Y17: U13.Y17(IO,_DIFFIO_B48n,_(DQS0B/CQ1B,CDPCLK3)/(DQS0B/CQ1B,CDPCLK3)/(DQS0B/CQ1B,CDPCLK3)) ; port Y17
NetU13_Y22: U13.Y22(IO,_DIFFIO_R49n,_(DQ3R)/(DQ3R)/(DQ1R)) ; port Y22

Not connected (* = marked no-connect by the designer): JP6 7* 8*; U13 A12(CLK8,_DIFFCLK_5n)* AA11(CLK15,_DIFFCLK_6p)* AA12(CLK13,_DIFFCLK_7p)* AB11(CLK14,_DIFFCLK_6n)* AB12(CLK12,_DIFFCLK_7n)* B11(CLK11,_DIFFCLK_4p)* B12(CLK9,_DIFFCLK_5p)* G1(CLK1,_DIFFCLK_0n)* G21(CLK4,_DIFFCLK_2p)* G22(CLK5,_DIFFCLK_2n)* T1(CLK3,_DIFFCLK_1n)* T2(CLK2,_DIFFCLK_1p)* T21(CLK6,_DIFFCLK_3p)* T22(CLK7,_DIFFCLK_3n)*

### Notes on the sheet
- FPGA BANK1
- FPGA BANK4
- FPGA BANK7
- Power Pin Out
- Reset
- FPGA BANK2
- FPGA BANK5
- FPGA BANK8
- FPGA BANK3
- FPGA BANK6
- (near U13) FPGA Power
- (near U13) FPGA Config
- (near U13) FPGA CLK
- FPGA JTAG
- FPGA FLASH
- XTAL 50MHz
- (in symbol EP4CE115F23C8, part A) BANK 1
- (in symbol EP4CE115F23C8, part B) BANK 2
- (in symbol EP4CE115F23C8, part C) BANK 3
- (in symbol EP4CE115F23C8, part D) BANK 4
- (in symbol EP4CE115F23C8, part E) BANK 5
- (in symbol EP4CE115F23C8, part F) BANK 6
- (in symbol EP4CE115F23C8, part G) BANK 7
- (in symbol EP4CE115F23C8, part H) BANK 8

### Library data of the parts
C57-C115 C117-C125 C147 = Cap
FB2 = FB: 磁珠
JP6 = Header 5PX2: 5*2P接插件; 版权归属: 源创客; BOM名称: 5*2P接插件; 学习资源: www.ooocke.com
R45-R58 = RES
U13 = EP4CE115F23C8: Cyclone IV Family FPGA, 2V Core, 280 I/O Pins, 4 PLLs, 484-Pin FBGA, Speed Grade 8, Commercial Grade; Published: 3-May-2010; DatasheetVersion: ver1.2, Mar-2010; PackageVersion: ver16.0, Dec-2009; PackageReference: FBGA484; Publisher: Altium Limited; PackageDescription: 484-Ball FineLine Ball Grid Array (FBGA484) - Flip Chip; Supplier 1: Digi-Key; Supplier Part Number 1: EP4CE115F23C8-ND; Code_JEDEC: MS-034-AAJ-1; Code_IPC: BGA100P22X22-484; ComponentLink1Description: Manufacturer Link; ComponentLink1URL: http://www.altera.com/; ComponentLink2Description: Handbook; ComponentLink2URL: http://www.altera.com/literature/hb/cyclone-iv/cyclone4-handbook.pdf; ComponentLink3Description: Pinout Specification; ComponentLink3URL: http://www.altera.com/literature/lit-dp.jsp?category=cyc%204&showspreadsheet=y; ComponentLink4Description: Packaging Specification; ComponentLink4URL: http://www.altera.com/literature/ds/dspkg.pdf
U14 = M25Pxx: 外置Flash; 版权归属: 源创客; BOM名称: 外置Flash; 学习资源: www.ooocke.com
Y1 = XTAL-4-Power: 4脚有源晶振

## Sheet Mother Board STM32.SchDoc
size A4
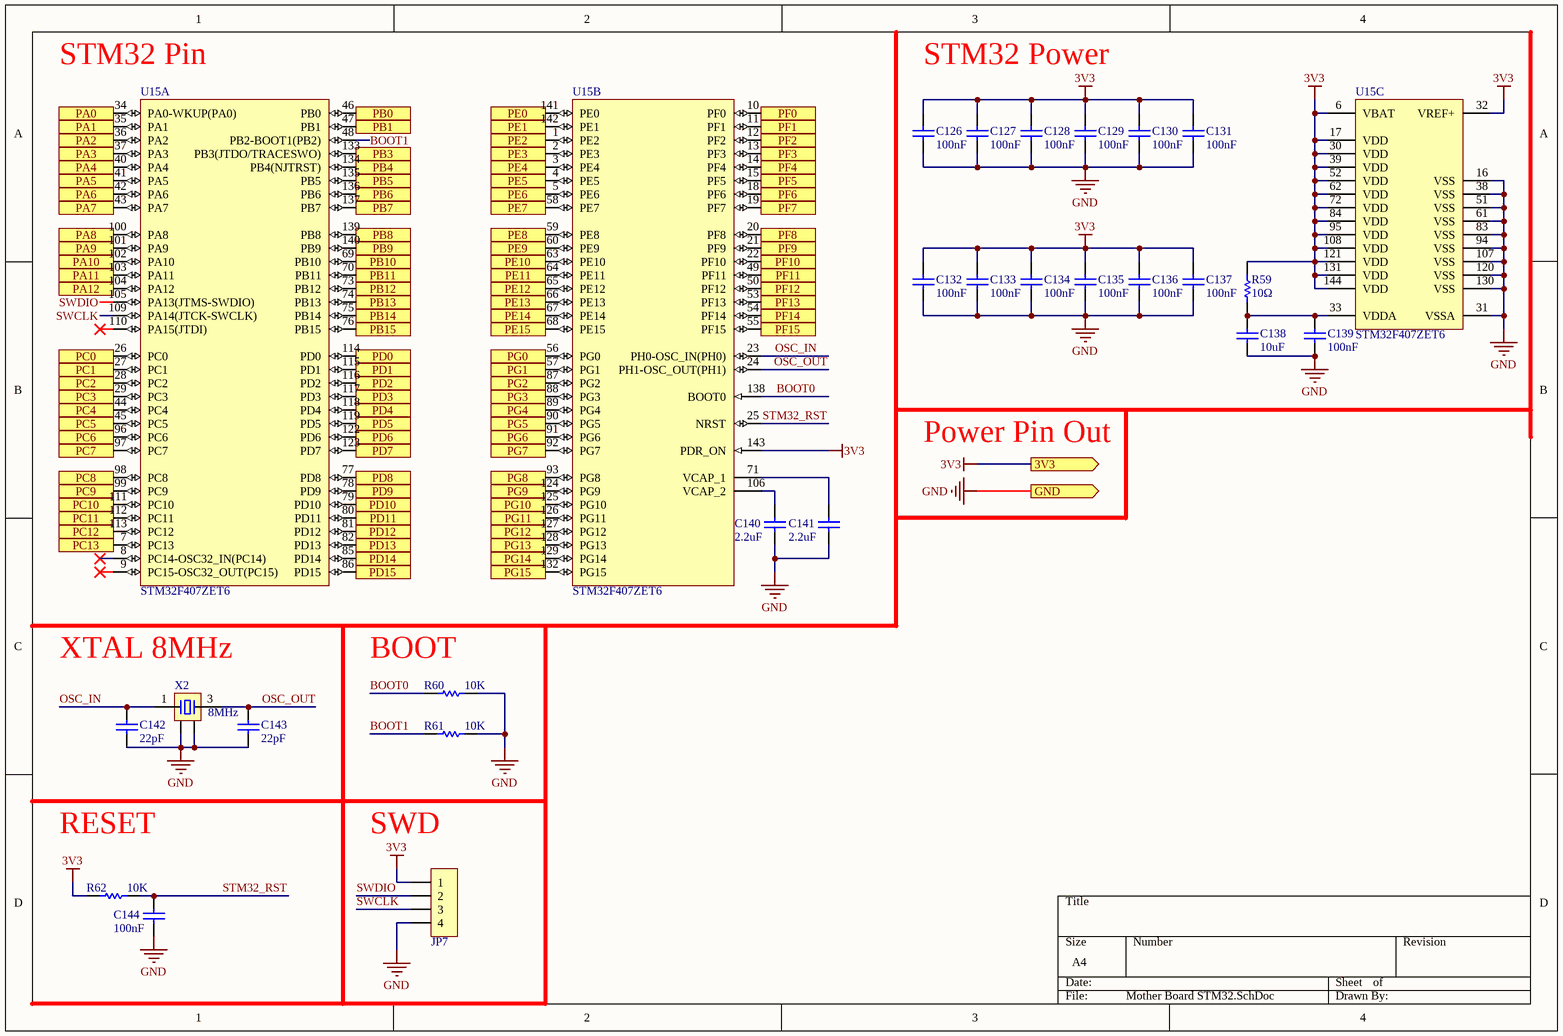
[diagram p10: Mother Board STM32.SchDoc]

### Parts
C126  100nF  [C0402]
C127  100nF  [C0402]
C128  100nF  [C0402]
C129  100nF  [C0402]
C130  100nF  [C0402]
C131  100nF  [C0402]
C132  100nF  [C0402]
C133  100nF  [C0402]
C134  100nF  [C0402]
C135  100nF  [C0402]
C136  100nF  [C0402]
C137  100nF  [C0402]
C138  10uF  [C0805]
C139  100nF  [C0402]
C140  2.2uF  [C0603]
C141  2.2uF  [C0603]
C142  22pF  [C0603]
C143  22pF  [C0603]
C144  100nF  [C0402]
JP7  HDR-1X4  [XH2.54-4P_H]  (value not drawn)
R59  10Ω  [R0402]
R60  10K  [R0402]
R61  10K  [R0402]
R62  10K  [R0402]
U15  STM32F407ZET6  [LQFP144 20X20_L]  (parts A,B,C of 3)
X2  8MHz  [XTAL-3225]

### Ports
3V3 (out), GND (out), PA0 (in), PA1 (in), PA2 (in), PA3 (in), PA4 (in), PA5 (in), PA6 (in), PA7 (in), PA8 (in), PA9 (in), PA10 (in), PA11 (in), PA12 (in), PB0 (in), PB1 (in), PB3 (in), PB4 (in), PB5 (in), PB6 (in), PB7 (in), PB8 (in), PB9 (in), PB10 (in), PB11 (in), PB12 (in), PB13 (in), PB14 (in), PB15 (in), PC0 (in), PC1 (in), PC2 (in), PC3 (in), PC4 (in), PC5 (in), PC6 (in), PC7 (in), PC8 (in), PC9 (in), PC10 (in), PC11 (in), PC12 (in), PC13 (in), PD0 (in), PD1 (in), PD2 (in), PD3 (in), PD4 (in), PD5 (in), PD6 (in), PD7 (in), PD8 (in), PD9 (in), PD10 (in), PD11 (in), PD12 (in), PD13 (in), PD14 (in), PD15 (in), PE0 (in), PE1 (in), PE2 (in), PE3 (in), PE4 (in), PE5 (in), PE6 (in), PE7 (in), PE8 (in), PE9 (in), PE10 (in), PE11 (in), PE12 (in), PE13 (in), PE14 (in), PE15 (in), PF0 (in), PF1 (in), PF2 (in), PF3 (in), PF4 (in), PF5 (in), PF6 (in), PF7 (in), PF8 (in), PF9 (in), PF10 (in), PF11 (in), PF12 (in), PF13 (in), PF14 (in), PF15 (in), PG0 (in), PG1 (in), PG2 (in), PG3 (in), PG4 (in), PG5 (in), PG6 (in), PG7 (in), PG8 (in), PG9 (in), PG10 (in), PG11 (in), PG12 (in), PG13 (in), PG14 (in), PG15 (in)

### Nets
3V3: C126.1 C127.1 C128.1 C129.1 C130.1 C131.1 C132.1 C133.1 C134.1 C135.1 C136.1 C137.1 JP7.1 R59.2 R62.1 U15.6(VBAT) U15.17(VDD) U15.30(VDD) U15.32(VREF+) U15.39(VDD) U15.52(VDD) U15.62(VDD) U15.72(VDD) U15.84(VDD) U15.95(VDD) U15.108(VDD) U15.121(VDD) U15.131(VDD) U15.143(PDR_ON) U15.144(VDD) ; port 3V3
GND: C126.2 C127.2 C128.2 C129.2 C130.2 C131.2 C132.2 C133.2 C134.2 C135.2 C136.2 C137.2 C138.2 C139.2 C140.1 C141.1 C142.1 C143.1 C144.1 JP7.4 R60.2 R61.2 U15.16(VSS) U15.31(VSSA) U15.38(VSS) U15.51(VSS) U15.61(VSS) U15.83(VSS) U15.94(VSS) U15.107(VSS) U15.120(VSS) U15.130(VSS) X2.2 X2.4 ; port GND
BOOT0: R60.1 U15.138(BOOT0)
BOOT1: R61.1 U15.48(PB2-BOOT1(PB2))
ETH MDC: U15.27(PC1) ; port PC1
ETH MDIO: U15.36(PA2) ; port PA2
ETH RESET: U15.117(PD3) ; port PD3
FSMC_A0: U15.10(PF0) ; port PF0
FSMC_A1: U15.11(PF1) ; port PF1
FSMC_A2: U15.12(PF2) ; port PF2
FSMC_A3: U15.13(PF3) ; port PF3
FSMC_A4: U15.14(PF4) ; port PF4
FSMC_A5: U15.15(PF5) ; port PF5
FSMC_A6: U15.50(PF12) ; port PF12
FSMC_A7: U15.53(PF13) ; port PF13
FSMC_A8: U15.54(PF14) ; port PF14
FSMC_A9: U15.55(PF15) ; port PF15
FSMC_A10: U15.56(PG0) ; port PG0
FSMC_A11: U15.57(PG1) ; port PG1
FSMC_D0: U15.85(PD14) ; port PD14
FSMC_D1: U15.86(PD15) ; port PD15
FSMC_D2: U15.114(PD0) ; port PD0
FSMC_D3: U15.115(PD1) ; port PD1
FSMC_D4: U15.58(PE7) ; port PE7
FSMC_D5: U15.59(PE8) ; port PE8
FSMC_D6: U15.60(PE9) ; port PE9
FSMC_D7: U15.63(PE10) ; port PE10
FSMC_D8: U15.64(PE11) ; port PE11
FSMC_D9: U15.65(PE12) ; port PE12
FSMC_D10: U15.66(PE13) ; port PE13
FSMC_D11: U15.67(PE14) ; port PE14
FSMC_D12: U15.68(PE15) ; port PE15
FSMC_D13: U15.77(PD8) ; port PD8
FSMC_D14: U15.78(PD9) ; port PD9
FSMC_D15: U15.79(PD10) ; port PD10
FSMC_NE2: U15.124(PG9) ; port PG9
FSMC_NOE: U15.118(PD4) ; port PD4
FSMC_NWE: U15.119(PD5) ; port PD5
LCD BLK: U15.136(PB6) ; port PB6
LCD CS: U15.137(PB7) ; port PB7
LCD DC: U15.134(PB4(NJTRST)) ; port PB4
LCD RES: U15.132(PG15) ; port PG15
LCD SDA: U15.135(PB5) ; port PB5
LCD SDL: U15.133(PB3(JTDO/TRACESWO)) ; port PB3
NRF CE: U15.2(PE3) ; port PE3
NRF CSN: U15.1(PE2) ; port PE2
NRF IRQ: U15.142(PE1) ; port PE1
NRF MISO: U15.28(PC2) ; port PC2
NRF MOSI: U15.29(PC3) ; port PC3
NRF SCK: U15.69(PB10) ; port PB10
OSC_IN: C142.2 U15.23(PH0-OSC_IN(PH0)) X2.1
OSC_OUT: C143.2 U15.24(PH1-OSC_OUT(PH1)) X2.3
RMII CRS DV: U15.43(PA7) ; port PA7
RMII REF CLK: U15.35(PA1) ; port PA1
RMII RXD0: U15.44(PC4) ; port PC4
RMII RXD1: U15.45(PC5) ; port PC5
RMII TXD0: U15.128(PG13) ; port PG13
RMII TXD1: U15.129(PG14) ; port PG14
RMII TXEN: U15.126(PG11) ; port PG11
STM32_RST: C144.2 R62.2 U15.25(NRST)
SWCLK: JP7.3 U15.109(PA14(JTCK-SWCLK))
SWDIO: JP7.2 U15.105(PA13(JTMS-SWDIO))
USB RXD: U15.101(PA9) ; port PA9
USB TXD: U15.102(PA10) ; port PA10
NetC138_1: C138.1 C139.1 R59.1 U15.33(VDDA)
NetC140_2: C140.2 U15.106(VCAP_2)
NetC141_2: C141.2 U15.71(VCAP_1)
NetU15_3: U15.3(PE4) ; port PE4
NetU15_4: U15.4(PE5) ; port PE5
NetU15_5: U15.5(PE6) ; port PE6
NetU15_7: U15.7(PC13) ; port PC13
NetU15_18: U15.18(PF6) ; port PF6
NetU15_19: U15.19(PF7) ; port PF7
NetU15_20: U15.20(PF8) ; port PF8
NetU15_21: U15.21(PF9) ; port PF9
NetU15_22: U15.22(PF10) ; port PF10
NetU15_26: U15.26(PC0) ; port PC0
NetU15_34: U15.34(PA0-WKUP(PA0)) ; port PA0
NetU15_37: U15.37(PA3) ; port PA3
NetU15_40: U15.40(PA4) ; port PA4
NetU15_41: U15.41(PA5) ; port PA5
NetU15_42: U15.42(PA6) ; port PA6
NetU15_46: U15.46(PB0) ; port PB0
NetU15_47: U15.47(PB1) ; port PB1
NetU15_49: U15.49(PF11) ; port PF11
NetU15_70: U15.70(PB11) ; port PB11
NetU15_73: U15.73(PB12) ; port PB12
NetU15_74: U15.74(PB13) ; port PB13
NetU15_75: U15.75(PB14) ; port PB14
NetU15_76: U15.76(PB15) ; port PB15
NetU15_80: U15.80(PD11) ; port PD11
NetU15_81: U15.81(PD12) ; port PD12
NetU15_82: U15.82(PD13) ; port PD13
NetU15_87: U15.87(PG2) ; port PG2
NetU15_88: U15.88(PG3) ; port PG3
NetU15_89: U15.89(PG4) ; port PG4
NetU15_90: U15.90(PG5) ; port PG5
NetU15_91: U15.91(PG6) ; port PG6
NetU15_92: U15.92(PG7) ; port PG7
NetU15_93: U15.93(PG8) ; port PG8
NetU15_96: U15.96(PC6) ; port PC6
NetU15_97: U15.97(PC7) ; port PC7
NetU15_98: U15.98(PC8) ; port PC8
NetU15_99: U15.99(PC9) ; port PC9
NetU15_100: U15.100(PA8) ; port PA8
NetU15_103: U15.103(PA11) ; port PA11
NetU15_104: U15.104(PA12) ; port PA12
NetU15_111: U15.111(PC10) ; port PC10
NetU15_112: U15.112(PC11) ; port PC11
NetU15_113: U15.113(PC12) ; port PC12
NetU15_116: U15.116(PD2) ; port PD2
NetU15_122: U15.122(PD6) ; port PD6
NetU15_123: U15.123(PD7) ; port PD7
NetU15_125: U15.125(PG10) ; port PG10
NetU15_127: U15.127(PG12) ; port PG12
NetU15_139: U15.139(PB8) ; port PB8
NetU15_140: U15.140(PB9) ; port PB9
NetU15_141: U15.141(PE0) ; port PE0

Not connected (* = marked no-connect by the designer): U15 8(PC14-OSC32_IN(PC14))* 9(PC15-OSC32_OUT(PC15))* 110(PA15(JTDI))*

### Notes on the sheet
- (near U15) STM32 Pin
- STM32 Power
- Power Pin Out
- XTAL 8MHz
- (near R60) BOOT
- RESET
- (near JP7) SWD

### Library data of the parts
C126-C144 = Cap
JP7 = Header 4P: 4P接插件; 版权归属: 源创客; BOM名称: 4P接插件; 学习资源: www.ooocke.com
R59-R62 = RES
U15 = STM32F407ZET6: ARM Cortex-M4 32-bit MCU+FPU, 210 DMIPS, 512 kB Flash, 192 kB Internal RAM, 114 I/Os, 144-pin LQFP, -40 to 85 degC, Tray; Manufacturer: STMicroelectronics; D/A Converter: 2x12-bit; FLASH Size (Prog) (kB): 512; I/Os (High Current): 114; Internal RAM Size (kB): 192; Operating Frequency(F) (Processor speed) (MHz): 168; Supply Voltage(Vcc) max (V): 3.6; Supply Voltage(Vcc) min (V): 1.8; DatasheetVersion: Rev. 4; PackageVersion: Rev. 4, 06/2013; PackageReference: LQFP144; PackageDescription: 144-Pin Low Profile Quad Flat Package, 20 x 20 mm Body, 0.5 mm Pitch; Supplier 1: Digi-Key; Supplier Part Number 1: 497-11903-ND; Supplier 2: Farnell; Supplier Part Number 2: 2215229; Supplier 3: Newark; Supplier Part Number 3: 46W2203; Supplier 4: Newark; Supplier Part Number 4: 87T3795; Supplier 5: Mouser; Supplier Part Number 5: 511-STM32F407ZET6; Core: ARM Cortex-M4; Packing: Tray; Mounting Technology: Surface Mount; PartNumber: STM32F407ZET6; ComponentLink1Description: Manufacturer URL; ComponentLink1URL: http://www.st.com/web/en/home.html; ComponentLink2Description: Datasheet; ComponentLink2URL: http://www.st.com/st-web-ui/static/active/en/resource/technical/document/datasheet/DM00037051.pdf; ComponentLink3Description: Package Specification; ComponentLink3URL: http://www.st.com/st-web-ui/static/active/en/resource/technical/document/datasheet/DM00037051.pdf
X2 = XTAL-4: 4脚晶振; 版权归属: 源创客; BOM名称: 4脚晶振; 学习资源: www.ooocke.com

## Nets that join several sheets
1V2: Mother Board Power (C21.1 C22.1 L4.1 R19.2), Mother Board FPGA (96 pins)
2V5: Mother Board Power (C19.1 C20.1 L3.1 R18.2), Mother Board FPGA (9 pins)
3V3: Mother Board Power (8 pins), Mother Board NRF24L01 (C145.1 C146.1 U16.1), Mother Board IMU (9 pins), Mother Board LCD (JP5.1), Mother Board Ethernet (C46.2 C149.1 FB1.1 U11.9), D4 (JP2_D4.9 JP2_D4.11), Mother Board FPGA (74 pins), Mother Board STM32 (30 pins), D3 (JP2_D3.9 JP2_D3.11), D2 (JP2_D2.9 JP2_D2.11), D1 (JP2_D1.9 JP2_D1.11)
5V: Mother Board Power (19 pins), D4 (C1_D4.2 JP1_D4.1 R6_D4.1 U1_D4.8), D3 (C1_D3.2 JP1_D3.1 R6_D3.1 U1_D3.8), D2 (C1_D2.2 JP1_D2.1 R6_D2.1 U1_D2.8), D1 (C1_D1.2 JP1_D1.1 R6_D1.1 U1_D1.8)
12V: Mother Board Power (5 pins), D4 (JP2_D4.13 JP2_D4.15), D3 (JP2_D3.13 JP2_D3.15), D2 (JP2_D2.13 JP2_D2.15), D1 (JP2_D1.13 JP2_D1.15)
EARTH: Mother Board Main (8 pins), Mother Board USB (USB1.3 USB1.4), Mother Board Ethernet (U10.13 U10.14), D4 (JP1_D4.7 JP1_D4.8), D3 (JP1_D3.7 JP1_D3.8), D2 (JP1_D2.7 JP1_D2.8), D1 (JP1_D1.7 JP1_D1.8)
GND: Mother Board Main (C148.1 R65.2), Mother Board Power (31 pins), Mother Board NRF24L01 (R63.2), Mother Board IMU (9 pins), Mother Board USB (8 pins), Mother Board LCD (JP5.8), Mother Board Ethernet (24 pins), D4 (15 pins), Mother Board FPGA (174 pins), Mother Board STM32 (34 pins), D3 (15 pins), D2 (15 pins), D1 (15 pins)
PGND: Mother Board Main (C116.1 R64.2), Mother Board Power (33 pins), D4 (H2_D4.1), D3 (H2_D3.1), D2 (H2_D2.1), D1 (H2_D1.1)
USB_5V: Mother Board Power (D3.A), Mother Board USB (7 pins)
Vpower: Mother Board Power (15 pins), D4 (H1_D4.1), D3 (H1_D3.1), D2 (H1_D2.1), D1 (H1_D1.1)
ClkA: D4 (JP2_D4.3), Mother Board FPGA (U13.M22)
ClkA: Mother Board FPGA (U13.N1), D1 (JP2_D1.3)
ClkA: Mother Board FPGA (U13.W2), D3 (JP2_D3.3)
ClkA: Mother Board FPGA (U13.V21), D2 (JP2_D2.3)
ClkC: D4 (JP2_D4.19), Mother Board FPGA (U13.W22)
ClkC: Mother Board FPGA (U13.M2), D3 (JP2_D3.19)
ClkC: Mother Board FPGA (U13.V1), D1 (JP2_D1.19)
ClkC: Mother Board FPGA (U13.N21), D2 (JP2_D2.19)
ClkVIN: Mother Board Power (U7.7), Mother Board FPGA (U13.L21)
DataA: D4 (JP2_D4.5), Mother Board FPGA (U13.M21)
DataA: Mother Board FPGA (U13.N2), D1 (JP2_D1.5)
DataA: Mother Board FPGA (U13.W1), D3 (JP2_D3.5)
DataA: Mother Board FPGA (U13.V22), D2 (JP2_D2.5)
DataC: D4 (JP2_D4.21), Mother Board FPGA (U13.W21)
DataC: Mother Board FPGA (U13.M1), D3 (JP2_D3.21)
DataC: Mother Board FPGA (U13.V2), D1 (JP2_D1.21)
DataC: Mother Board FPGA (U13.N22), D2 (JP2_D2.21)
DataVIN: Mother Board Power (U7.6), Mother Board FPGA (U13.L22)
ETH MDC: Mother Board Ethernet (U11.13), Mother Board STM32 (U15.27)
ETH MDIO: Mother Board Ethernet (R42.1), Mother Board STM32 (U15.36)
ETH RESET: Mother Board Ethernet (R43.1 U11.15), Mother Board STM32 (U15.117)
FSMC_A0: Mother Board FPGA (U13.AA7), Mother Board STM32 (U15.10)
FSMC_A1: Mother Board FPGA (U13.AB7), Mother Board STM32 (U15.11)
FSMC_A2: Mother Board FPGA (U13.AA8), Mother Board STM32 (U15.12)
FSMC_A3: Mother Board FPGA (U13.AB8), Mother Board STM32 (U15.13)
FSMC_A4: Mother Board FPGA (U13.AA9), Mother Board STM32 (U15.14)
FSMC_A5: Mother Board FPGA (U13.AB9), Mother Board STM32 (U15.15)
FSMC_A6: Mother Board FPGA (U13.Y13), Mother Board STM32 (U15.50)
FSMC_A7: Mother Board FPGA (U13.Y14), Mother Board STM32 (U15.53)
FSMC_A8: Mother Board FPGA (U13.Y15), Mother Board STM32 (U15.54)
FSMC_A9: Mother Board FPGA (U13.AA15), Mother Board STM32 (U15.55)
FSMC_A10: Mother Board FPGA (U13.AA16), Mother Board STM32 (U15.56)
FSMC_A11: Mother Board FPGA (U13.AB16), Mother Board STM32 (U15.57)
FSMC_D0: Mother Board FPGA (U13.AB13), Mother Board STM32 (U15.85)
FSMC_D1: Mother Board FPGA (U13.AA13), Mother Board STM32 (U15.86)
FSMC_D2: Mother Board FPGA (U13.AA5), Mother Board STM32 (U15.114)
FSMC_D3: Mother Board FPGA (U13.AB5), Mother Board STM32 (U15.115)
FSMC_D4: Mother Board FPGA (U13.AA17), Mother Board STM32 (U15.58)
FSMC_D5: Mother Board FPGA (U13.AB17), Mother Board STM32 (U15.59)
FSMC_D6: Mother Board FPGA (U13.AA18), Mother Board STM32 (U15.60)
FSMC_D7: Mother Board FPGA (U13.AB18), Mother Board STM32 (U15.63)
FSMC_D8: Mother Board FPGA (U13.AA19), Mother Board STM32 (U15.64)
FSMC_D9: Mother Board FPGA (U13.AB19), Mother Board STM32 (U15.65)
FSMC_D10: Mother Board FPGA (U13.AA20), Mother Board STM32 (U15.66)
FSMC_D11: Mother Board FPGA (U13.AB20), Mother Board STM32 (U15.67)
FSMC_D12: Mother Board FPGA (U13.AA21), Mother Board STM32 (U15.68)
FSMC_D13: Mother Board FPGA (U13.AB15), Mother Board STM32 (U15.77)
FSMC_D14: Mother Board FPGA (U13.AB14), Mother Board STM32 (U15.78)
FSMC_D15: Mother Board FPGA (U13.AA14), Mother Board STM32 (U15.79)
FSMC_NE2: Mother Board FPGA (U13.AB4), Mother Board STM32 (U15.124)
FSMC_NOE: Mother Board FPGA (U13.AA6), Mother Board STM32 (U15.118)
FSMC_NWE: Mother Board FPGA (U13.AB6), Mother Board STM32 (U15.119)
IMU nCS BMP280: Mother Board IMU (U8.2), Mother Board FPGA (U13.H1)
IMU nCS MPU9250: Mother Board IMU (U9.22), Mother Board FPGA (U13.F2)
IMU SCLK: Mother Board IMU (U8.4 U9.23), Mother Board FPGA (U13.F1)
IMU SDI: Mother Board IMU (U8.3 U9.24), Mother Board FPGA (U13.H2)
IMU SDO: Mother Board IMU (U8.5 U9.9), Mother Board FPGA (U13.J2)
INa: D4 (JP2_D4.6), Mother Board FPGA (U13.R20)
INa: Mother Board FPGA (U13.P2), D1 (JP2_D1.6)
INa: Mother Board FPGA (U13.T4), D3 (JP2_D3.6)
INa: Mother Board FPGA (U13.U22), D2 (JP2_D2.6)
INb: D4 (JP2_D4.14), Mother Board FPGA (U13.T20)
INb: Mother Board FPGA (U13.R2), D1 (JP2_D1.14)
INb: Mother Board FPGA (U13.R4), D3 (JP2_D3.14)
INb: Mother Board FPGA (U13.R22), D2 (JP2_D2.14)
INc: D4 (JP2_D4.22), Mother Board FPGA (U13.U20)
INc: Mother Board FPGA (U13.P4), D3 (JP2_D3.22)
INc: Mother Board FPGA (U13.U2), D1 (JP2_D1.22)
INc: Mother Board FPGA (U13.P22), D2 (JP2_D2.22)
LCD BLK: Mother Board LCD (JP5.2), Mother Board STM32 (U15.136)
LCD CS: Mother Board LCD (JP5.4), Mother Board STM32 (U15.137)
LCD DC: Mother Board LCD (JP5.3), Mother Board STM32 (U15.134)
LCD RES: Mother Board LCD (JP5.7), Mother Board STM32 (U15.132)
LCD SDA: Mother Board LCD (JP5.6), Mother Board STM32 (U15.135)
LCD SDL: Mother Board LCD (JP5.5), Mother Board STM32 (U15.133)
NRF CE: Mother Board NRF24L01 (U16.2), Mother Board STM32 (U15.2)
NRF CSN: Mother Board NRF24L01 (U16.3), Mother Board STM32 (U15.1)
NRF IRQ: Mother Board NRF24L01 (U16.7), Mother Board STM32 (U15.142)
NRF MISO: Mother Board NRF24L01 (U16.6), Mother Board STM32 (U15.28)
NRF MOSI: Mother Board NRF24L01 (U16.5), Mother Board STM32 (U15.29)
NRF SCK: Mother Board NRF24L01 (U16.4), Mother Board STM32 (U15.69)
Pos DIR: D4 (R3_D4.1), Mother Board FPGA (U13.B22)
Pos DIR: Mother Board FPGA (U13.B1), D3 (R3_D3.1)
Pos DIR: Mother Board FPGA (U13.AB3), D1 (R3_D1.1)
Pos DIR: Mother Board FPGA (U13.AA10), D2 (R3_D2.1)
Pos RXD: D4 (R2_D4.1), Mother Board FPGA (U13.B21)
Pos RXD: Mother Board FPGA (U13.C2), D3 (R2_D3.1)
Pos RXD: Mother Board FPGA (U13.AA4), D1 (R2_D1.1)
Pos RXD: Mother Board FPGA (U13.AB10), D2 (R2_D2.1)
Pos TXD: D4 (R5_D4.1), Mother Board FPGA (U13.C21)
Pos TXD: Mother Board FPGA (U13.B2), D3 (R5_D3.1)
Pos TXD: Mother Board FPGA (U13.AA3), D1 (R5_D1.1)
Pos TXD: Mother Board FPGA (U13.Y10), D2 (R5_D2.1)
RMII CRS DV: Mother Board Ethernet (U11.11), Mother Board STM32 (U15.43)
RMII REF CLK: Mother Board Ethernet (U11.14), Mother Board STM32 (U15.35)
RMII RXD0: Mother Board Ethernet (U11.8), Mother Board STM32 (U15.44)
RMII RXD1: Mother Board Ethernet (U11.7), Mother Board STM32 (U15.45)
RMII TXD0: Mother Board Ethernet (U11.17), Mother Board STM32 (U15.128)
RMII TXD1: Mother Board Ethernet (U11.18), Mother Board STM32 (U15.129)
RMII TXEN: Mother Board Ethernet (U11.16), Mother Board STM32 (U15.126)
SDa: D4 (JP2_D4.4), Mother Board FPGA (U13.P20)
SDa: Mother Board FPGA (U13.P1), D1 (JP2_D1.4)
SDa: Mother Board FPGA (U13.T3), D3 (JP2_D3.4)
SDa: Mother Board FPGA (U13.U21), D2 (JP2_D2.4)
SDb: D4 (JP2_D4.12), Mother Board FPGA (U13.R19)
SDb: Mother Board FPGA (U13.R1), D1 (JP2_D1.12)
SDb: Mother Board FPGA (U13.R3), D3 (JP2_D3.12)
SDb: Mother Board FPGA (U13.R21), D2 (JP2_D2.12)
SDc: D4 (JP2_D4.20), Mother Board FPGA (U13.T19)
SDc: Mother Board FPGA (U13.P3), D3 (JP2_D3.20)
SDc: Mother Board FPGA (U13.U1), D1 (JP2_D1.20)
SDc: Mother Board FPGA (U13.P21), D2 (JP2_D2.20)
USB RXD: Mother Board USB (U12.9), Mother Board STM32 (U15.101)
USB TXD: Mother Board USB (U12.8), Mother Board STM32 (U15.102)